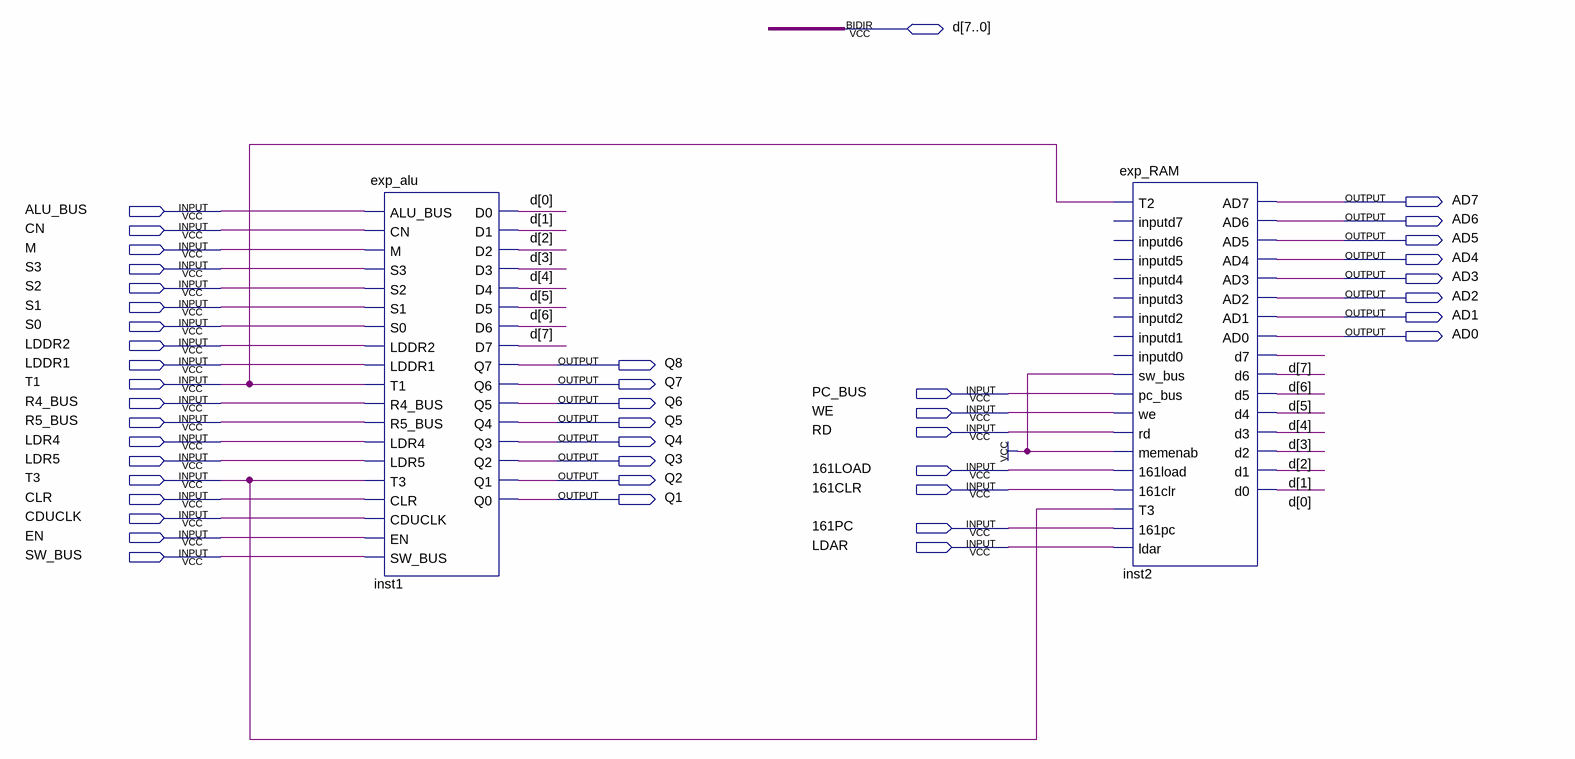
[diagram p0: schematic sheet]
// Quartus schematic datapath.bdf as structural Verilog: 2 symbols, 43 pins
module datapath (
  input  ALU_BUS,
  input  CN,
  input  M,
  input  S3,
  input  S2,
  input  S1,
  input  S0,
  input  LDDR2,
  input  LDDR1,
  input  T1,
  input  PC_BUS,
  input  R4_BUS,
  input  WE,
  input  R5_BUS,
  input  RD,
  input  LDR4,
  input  LDR5,
  input  \161LOAD ,
  input  T3,
  input  \161CLR ,
  input  CLR,
  input  CDUCLK,
  input  \161PC ,
  input  EN,
  input  LDAR,
  input  SW_BUS,
  inout  [7:0] d,
  output AD7,
  output AD6,
  output AD5,
  output AD4,
  output AD3,
  output AD2,
  output AD1,
  output AD0,
  output Q8,
  output Q7,
  output Q6,
  output Q5,
  output Q4,
  output Q3,
  output Q2,
  output Q1
);

  exp_alu inst1 (
    .ALU_BUS(ALU_BUS), .CN(CN), .M(M), .S3(S3), .S2(S2), .S1(S1), .S0(S0), .LDDR2(LDDR2), .LDDR1(LDDR1),
    .T1(T1), .R4_BUS(R4_BUS), .R5_BUS(R5_BUS), .LDR4(LDR4), .LDR5(LDR5), .T3(T3), .CLR(CLR), .CDUCLK(CDUCLK),
    .EN(EN), .SW_BUS(SW_BUS), .Q7(Q8), .Q6(Q7), .Q5(Q6), .Q4(Q5), .Q3(Q4), .Q2(Q3), .Q1(Q2), .Q0(Q1),
    .D0(d[0]), .D1(d[1]), .D2(d[2]), .D3(d[3]), .D4(d[4]), .D5(d[5]), .D6(d[6]), .D7(d[7]));
  exp_RAM inst2 (
    .T2(T1), .sw_bus(1'b1), .pc_bus(PC_BUS), .we(WE), .rd(RD), .memenab(1'b1), .\161load (\161LOAD ),
    .\161clr (\161CLR ), .T3(T3), .\161pc (\161PC ), .ldar(LDAR), .AD7(AD7), .AD6(AD6), .AD5(AD5), .AD4(AD4),
    .AD3(AD3), .AD2(AD2), .AD1(AD1), .AD0(AD0), .d7(d[7]), .d6(d[6]), .d5(d[5]), .d4(d[4]), .d3(d[3]),
    .d2(d[2]), .d1(d[1]), .d0(d[0]));  // open: inputd7, inputd6, inputd5, inputd4, inputd3, inputd2, inputd1, inputd0
endmodule
